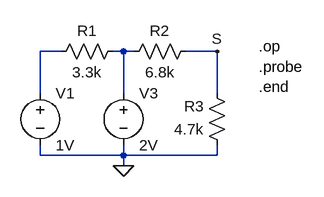
[diagram p0: schematic op.asc]
op.asc, the LTspice schematic file:
Version 4
SHEET 1 880 680
WIRE 272 144 240 144
WIRE 368 144 352 144
WIRE 384 144 368 144
WIRE 512 144 464 144
WIRE 240 208 240 144
WIRE 368 208 368 144
WIRE 512 208 512 144
WIRE 240 304 240 288
WIRE 368 304 368 288
WIRE 368 304 240 304
WIRE 512 304 512 288
WIRE 512 304 368 304
WIRE 368 320 368 304
FLAG 368 320 0
FLAG 512 144 S
SYMBOL Res 368 128 R90
WINDOW 0 0 56 VBottom 2
WINDOW 3 32 56 VTop 2
SYMATTR InstName R1
SYMATTR Value 3.3k
SYMBOL Res 480 128 R90
WINDOW 0 0 56 VBottom 2
WINDOW 3 32 56 VTop 2
SYMATTR InstName R2
SYMATTR Value 6.8k
SYMBOL Res 528 304 R180
WINDOW 0 36 76 Left 2
WINDOW 3 36 40 Left 2
SYMATTR InstName R3
SYMATTR Value 4.7k
SYMBOL Voltage 368 192 R0
SYMATTR InstName V3
SYMATTR Value 2V
SYMBOL Voltage 240 192 R0
SYMATTR InstName V1
SYMATTR Value 1V
TEXT 576 136 Left 2 !.op\n.probe\n.end

The netlist it stands for:
* op.asc
R1 N002 N001 3.3k
R2 S N002 6.8k
R3 0 S 4.7k
V3 N002 0 2V
V1 N001 0 1V
.op
.probe
.end
.backanno
.end